# Altium schematic sheet MB1184.SchDoc: STM32L476 Discovery
size A4; Date: 01-DEC-2013; Author: A.B; CompanyName: STMicroelectronics; Organization: Microcontrollers Division; Address1: 12, Rue Jules HOROWITZ; Address2: 38019 Grenoble; Address3: FRANCE; DocumentNumber: MB1184; Revision: C-01; SheetNumber: 1; SheetTotal: 10; Project: STM32L476G-DISCO
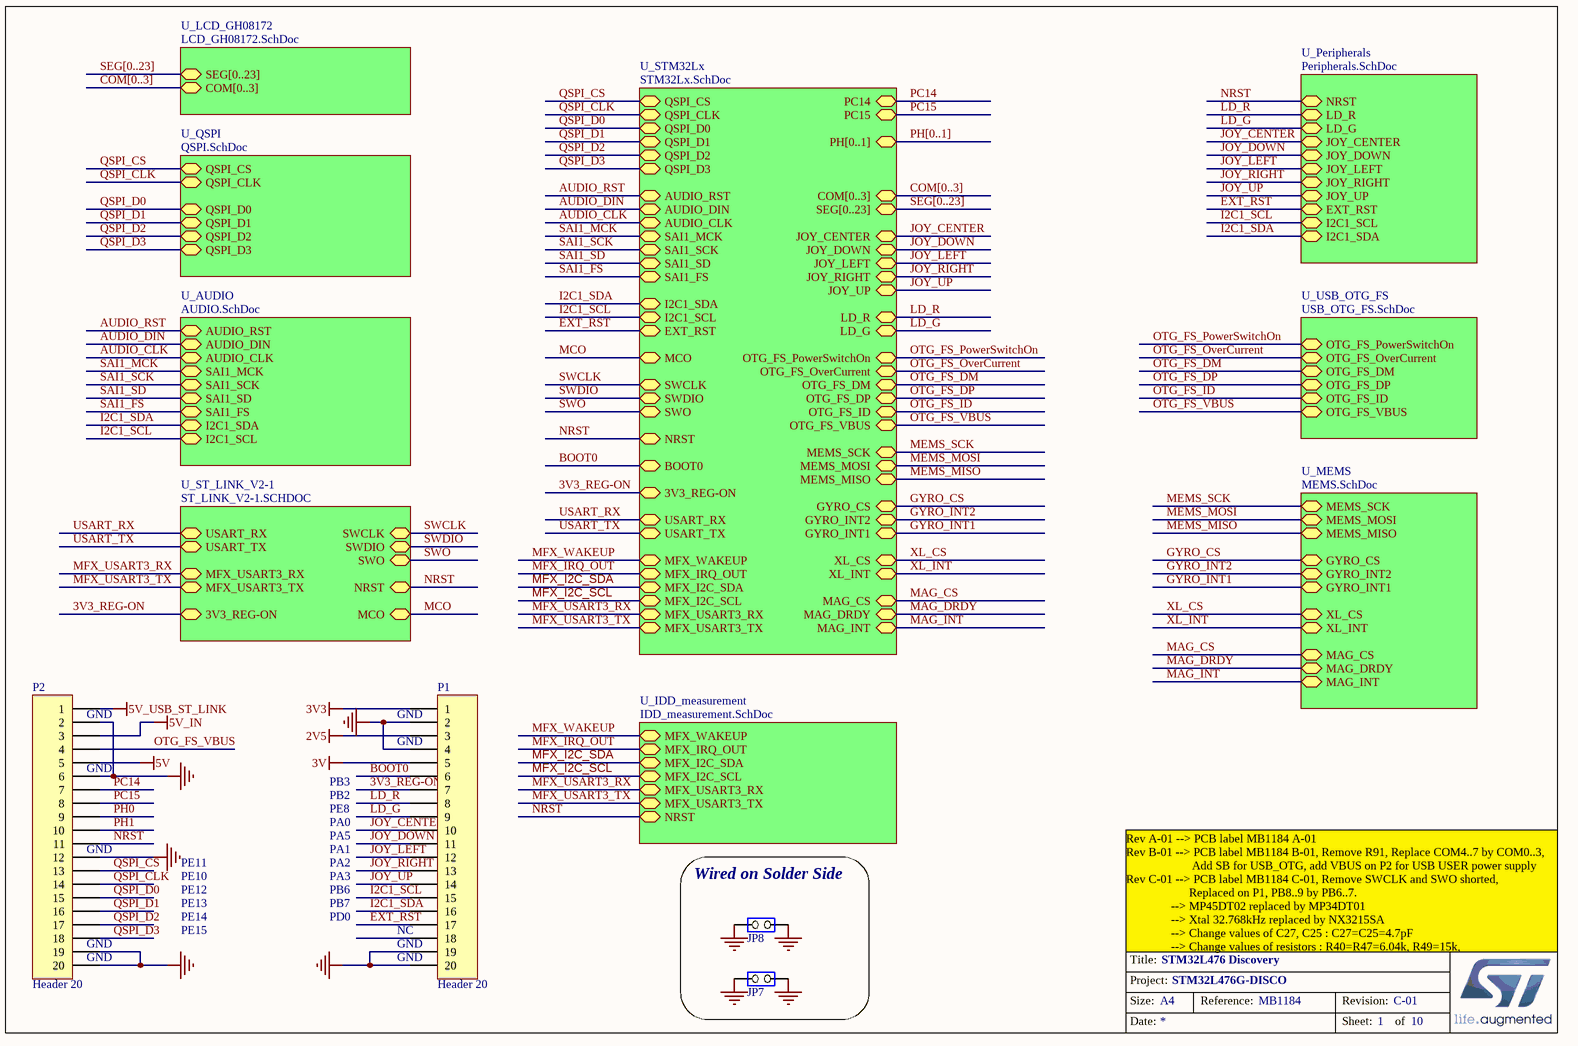
[diagram p0: MB1184.SchDoc]

## Parts
JP7  Jumper 2 pins  [SIP2/2.54]  (value not drawn)
JP8  Jumper 2 pins  [SIP2/2.54]  (value not drawn)
P1  Header 20  [HDR1X20]
P2  Header 20  [HDR1X20]

## Blocks framed on the sheet
Wired on Solder Side: JP7 JP8

## Sub-sheets
U_AUDIO = AUDIO.SchDoc: AUDIO_CLK, AUDIO_DIN, AUDIO_RST, SAI1_FS, SAI1_SD, SAI1_SCK, I2C1_SCL, I2C1_SDA, SAI1_MCK
U_IDD_measurement = IDD_measurement.SchDoc: MFX_WAKEUP, MFX_IRQ_OUT, MFX_I2C_SDA, MFX_I2C_SCL, MFX_USART3_RX, MFX_USART3_TX, NRST
U_LCD_GH08172 = LCD_GH08172.SchDoc: SEG[0..23], COM[0..3]
U_MEMS = MEMS.SchDoc: GYRO_CS, MAG_CS, MAG_INT, XL_INT, MAG_DRDY, MEMS_SCK, MEMS_MISO, MEMS_MOSI, GYRO_INT1, GYRO_INT2, XL_CS
U_Peripherals = Peripherals.SchDoc: NRST, LD_R, LD_G, EXT_RST, JOY_CENTER, JOY_DOWN, JOY_LEFT, JOY_RIGHT, JOY_UP, I2C1_SCL, I2C1_SDA
U_QSPI = QSPI.SchDoc: QSPI_D0, QSPI_D3, QSPI_D2 (bidir), QSPI_D1, QSPI_CLK, QSPI_CS
U_ST_LINK_V2-1 = ST_LINK_V2-1.SCHDOC: SWDIO, SWCLK, MCO, NRST, USART_RX, USART_TX, MFX_USART3_RX, MFX_USART3_TX, SWO, 3V3_REG-ON
U_STM32Lx = STM32Lx.SchDoc: NRST, MCO, LD_R, SWCLK, SWDIO, USART_TX, USART_RX, LD_G, MFX_IRQ_OUT, MFX_WAKEUP, QSPI_D0, QSPI_D3, QSPI_D2 (bidir), QSPI_D1, QSPI_CLK, QSPI_CS, SAI1_FS, SAI1_SD, SAI1_SCK, I2C1_SCL, I2C1_SDA, AUDIO_RST, SAI1_MCK, AUDIO_DIN, AUDIO_CLK, OTG_FS_PowerSwitchOn, OTG_FS_DM, OTG_FS_DP, OTG_FS_ID, OTG_FS_VBUS, OTG_FS_OverCurrent, SEG[0..23], COM[0..3], EXT_RST, PH[0..1], JOY_CENTER, JOY_DOWN, JOY_LEFT, JOY_RIGHT, JOY_UP, MEMS_SCK, MEMS_MISO, MEMS_MOSI, GYRO_CS, GYRO_INT1, GYRO_INT2, XL_CS, XL_INT, MAG_CS, MAG_DRDY, MAG_INT, MFX_USART3_RX, MFX_USART3_TX, MFX_I2C_SDA, MFX_I2C_SCL, BOOT0, SWO, 3V3_REG-ON, PC14, PC15
U_USB_OTG_FS = USB_OTG_FS.SchDoc: OTG_FS_PowerSwitchOn, OTG_FS_OverCurrent, OTG_FS_DM, OTG_FS_DP, OTG_FS_ID, OTG_FS_VBUS

## Nets
2V5: P1.3
3V: P1.5
3V3: P1.1
5V: P2.5
5V_IN: P2.3
5V_USB_ST_LINK: P2.1
GND: JP7.1(COMMON) JP7.2(NO) JP8.1(COMMON) JP8.2(NO) P1.2 P1.4 P1.19 P1.20 P2.2 P2.6 P2.12 P2.19 P2.20
3V3_REG-ON: P1.7 ; sheet U_STM32Lx/3V3_REG-ON, sheet U_ST_LINK_V2-1/3V3_REG-ON
AUDIO_CLK: sheet U_STM32Lx/AUDIO_CLK, sheet U_AUDIO/AUDIO_CLK
AUDIO_DIN: sheet U_STM32Lx/AUDIO_DIN, sheet U_AUDIO/AUDIO_DIN
AUDIO_RST: sheet U_STM32Lx/AUDIO_RST, sheet U_AUDIO/AUDIO_RST
BOOT0: P1.6 ; sheet U_STM32Lx/BOOT0
EXT_RST: P1.17 ; sheet U_STM32Lx/EXT_RST, sheet U_Peripherals/EXT_RST
GYRO_CS: sheet U_STM32Lx/GYRO_CS, sheet U_MEMS/GYRO_CS
GYRO_INT1: sheet U_STM32Lx/GYRO_INT1, sheet U_MEMS/GYRO_INT1
GYRO_INT2: sheet U_STM32Lx/GYRO_INT2, sheet U_MEMS/GYRO_INT2
I2C1_SCL: P1.15 ; sheet U_STM32Lx/I2C1_SCL, sheet U_AUDIO/I2C1_SCL, sheet U_Peripherals/I2C1_SCL
I2C1_SDA: P1.16 ; sheet U_STM32Lx/I2C1_SDA, sheet U_AUDIO/I2C1_SDA, sheet U_Peripherals/I2C1_SDA
JOY_CENTER: P1.10 ; sheet U_STM32Lx/JOY_CENTER, sheet U_Peripherals/JOY_CENTER
JOY_DOWN: P1.11 ; sheet U_STM32Lx/JOY_DOWN, sheet U_Peripherals/JOY_DOWN
JOY_LEFT: P1.12 ; sheet U_STM32Lx/JOY_LEFT, sheet U_Peripherals/JOY_LEFT
JOY_RIGHT: P1.13 ; sheet U_STM32Lx/JOY_RIGHT, sheet U_Peripherals/JOY_RIGHT
JOY_UP: P1.14 ; sheet U_STM32Lx/JOY_UP, sheet U_Peripherals/JOY_UP
LD_G: P1.9 ; sheet U_STM32Lx/LD_G, sheet U_Peripherals/LD_G
LD_R: P1.8 ; sheet U_STM32Lx/LD_R, sheet U_Peripherals/LD_R
MAG_CS: sheet U_STM32Lx/MAG_CS, sheet U_MEMS/MAG_CS
MAG_DRDY: sheet U_STM32Lx/MAG_DRDY, sheet U_MEMS/MAG_DRDY
MAG_INT: sheet U_STM32Lx/MAG_INT, sheet U_MEMS/MAG_INT
MCO: sheet U_STM32Lx/MCO, sheet U_ST_LINK_V2-1/MCO
MEMS_MISO: sheet U_STM32Lx/MEMS_MISO, sheet U_MEMS/MEMS_MISO
MEMS_MOSI: sheet U_STM32Lx/MEMS_MOSI, sheet U_MEMS/MEMS_MOSI
MEMS_SCK: sheet U_STM32Lx/MEMS_SCK, sheet U_MEMS/MEMS_SCK
MFX_I2C_SCL: sheet U_STM32Lx/MFX_I2C_SCL, sheet U_IDD_measurement/MFX_I2C_SCL
MFX_I2C_SDA: sheet U_STM32Lx/MFX_I2C_SDA, sheet U_IDD_measurement/MFX_I2C_SDA
MFX_IRQ_OUT: sheet U_STM32Lx/MFX_IRQ_OUT, sheet U_IDD_measurement/MFX_IRQ_OUT
MFX_USART3_RX: sheet U_STM32Lx/MFX_USART3_RX, sheet U_ST_LINK_V2-1/MFX_USART3_RX, sheet U_IDD_measurement/MFX_USART3_RX
MFX_USART3_TX: sheet U_STM32Lx/MFX_USART3_TX, sheet U_ST_LINK_V2-1/MFX_USART3_TX, sheet U_IDD_measurement/MFX_USART3_TX
MFX_WAKEUP: sheet U_STM32Lx/MFX_WAKEUP, sheet U_IDD_measurement/MFX_WAKEUP
NRST: P2.11 ; sheet U_STM32Lx/NRST, sheet U_ST_LINK_V2-1/NRST, sheet U_IDD_measurement/NRST, sheet U_Peripherals/NRST
OTG_FS_DM: sheet U_STM32Lx/OTG_FS_DM, sheet U_USB_OTG_FS/OTG_FS_DM
OTG_FS_DP: sheet U_STM32Lx/OTG_FS_DP, sheet U_USB_OTG_FS/OTG_FS_DP
OTG_FS_ID: sheet U_STM32Lx/OTG_FS_ID, sheet U_USB_OTG_FS/OTG_FS_ID
OTG_FS_OverCurrent: sheet U_STM32Lx/OTG_FS_OverCurrent, sheet U_USB_OTG_FS/OTG_FS_OverCurrent
OTG_FS_PowerSwitchOn: sheet U_STM32Lx/OTG_FS_PowerSwitchOn, sheet U_USB_OTG_FS/OTG_FS_PowerSwitchOn
OTG_FS_VBUS: P2.4 ; sheet U_STM32Lx/OTG_FS_VBUS, sheet U_USB_OTG_FS/OTG_FS_VBUS
PC14: P2.7 ; sheet U_STM32Lx/PC14
PC15: P2.8 ; sheet U_STM32Lx/PC15
PH0: P2.9
PH1: P2.10
QSPI_CLK: P2.14 ; sheet U_STM32Lx/QSPI_CLK, sheet U_QSPI/QSPI_CLK
QSPI_CS: P2.13 ; sheet U_STM32Lx/QSPI_CS, sheet U_QSPI/QSPI_CS
QSPI_D0: P2.15 ; sheet U_STM32Lx/QSPI_D0, sheet U_QSPI/QSPI_D0
QSPI_D1: P2.16 ; sheet U_STM32Lx/QSPI_D1, sheet U_QSPI/QSPI_D1
QSPI_D2: P2.17 ; sheet U_STM32Lx/QSPI_D2, sheet U_QSPI/QSPI_D2
QSPI_D3: P2.18 ; sheet U_STM32Lx/QSPI_D3, sheet U_QSPI/QSPI_D3
SAI1_FS: sheet U_STM32Lx/SAI1_FS, sheet U_AUDIO/SAI1_FS
SAI1_MCK: sheet U_STM32Lx/SAI1_MCK, sheet U_AUDIO/SAI1_MCK
SAI1_SCK: sheet U_STM32Lx/SAI1_SCK, sheet U_AUDIO/SAI1_SCK
SAI1_SD: sheet U_STM32Lx/SAI1_SD, sheet U_AUDIO/SAI1_SD
SWCLK: sheet U_STM32Lx/SWCLK, sheet U_ST_LINK_V2-1/SWCLK
SWDIO: sheet U_STM32Lx/SWDIO, sheet U_ST_LINK_V2-1/SWDIO
SWO: sheet U_STM32Lx/SWO, sheet U_ST_LINK_V2-1/SWO
USART_RX: sheet U_STM32Lx/USART_RX, sheet U_ST_LINK_V2-1/USART_RX
USART_TX: sheet U_STM32Lx/USART_TX, sheet U_ST_LINK_V2-1/USART_TX
XL_CS: sheet U_STM32Lx/XL_CS, sheet U_MEMS/XL_CS
XL_INT: sheet U_STM32Lx/XL_INT, sheet U_MEMS/XL_INT

Not connected (* = marked no-connect by the designer): P1 18

## Buses and harness runs
bus COM[0..3] = sheet U_LCD_GH08172/COM[0..3]
bus COM[0..3] = sheet U_STM32Lx/COM[0..3]
bus PH[0..1] = sheet U_STM32Lx/PH[0..1]
bus SEG[0..23] = sheet U_LCD_GH08172/SEG[0..23]
bus SEG[0..23] = sheet U_STM32Lx/SEG[0..23]

## Notes on the sheet
- (near P2) GND
- (near P1) GND
- PB3
- PB2
- PE8
- PA0
- PA5
- PA1
- PE11
- PE10
- PE12
- PE13
- PE14
- PA2
- PA3
- PB6
- PB7
- PD0
- PE15
- (near P1) NC
- Rev A-01 --> PCB label MB1184 A-01
  Rev B-01 --> PCB label MB1184 B-01, Remove R91, Replace COM4..7 by COM0..3,
  Add SB for USB_OTG, add VBUS on P2 for USB USER power supply
  Rev C-01 --> PCB label MB1184 C-01, Remove SWCLK and SWO shorted,
  Replaced on P1, PB8..9 by PB6..7.
  --> MP45DT02 replaced by MP34DT01
  --> Xtal 32.768kHz replaced by NX3215SA
  --> Change values of C27, C25 : C27=C25=4.7pF
  --> Change values of resistors : R40=R47=6.04k, R49=15k, R48=R42=R50=300k
- Title:
- Project:
- Size:
- Date:
- A4
- Reference:
- Sheet:
- Revision:
- of

## Library data of the parts
JP7 JP8 = Jumper2: ECCN_US/EU: n/a
P1 P2 = Header 20: Header, 20-Pin; LatestRevisionDate: 17-Jul-2002; LatestRevisionNote: Re-released for DXP Platform.; Publisher: Altium Limited